# Altium project Pi3_SMD.PrjPcb
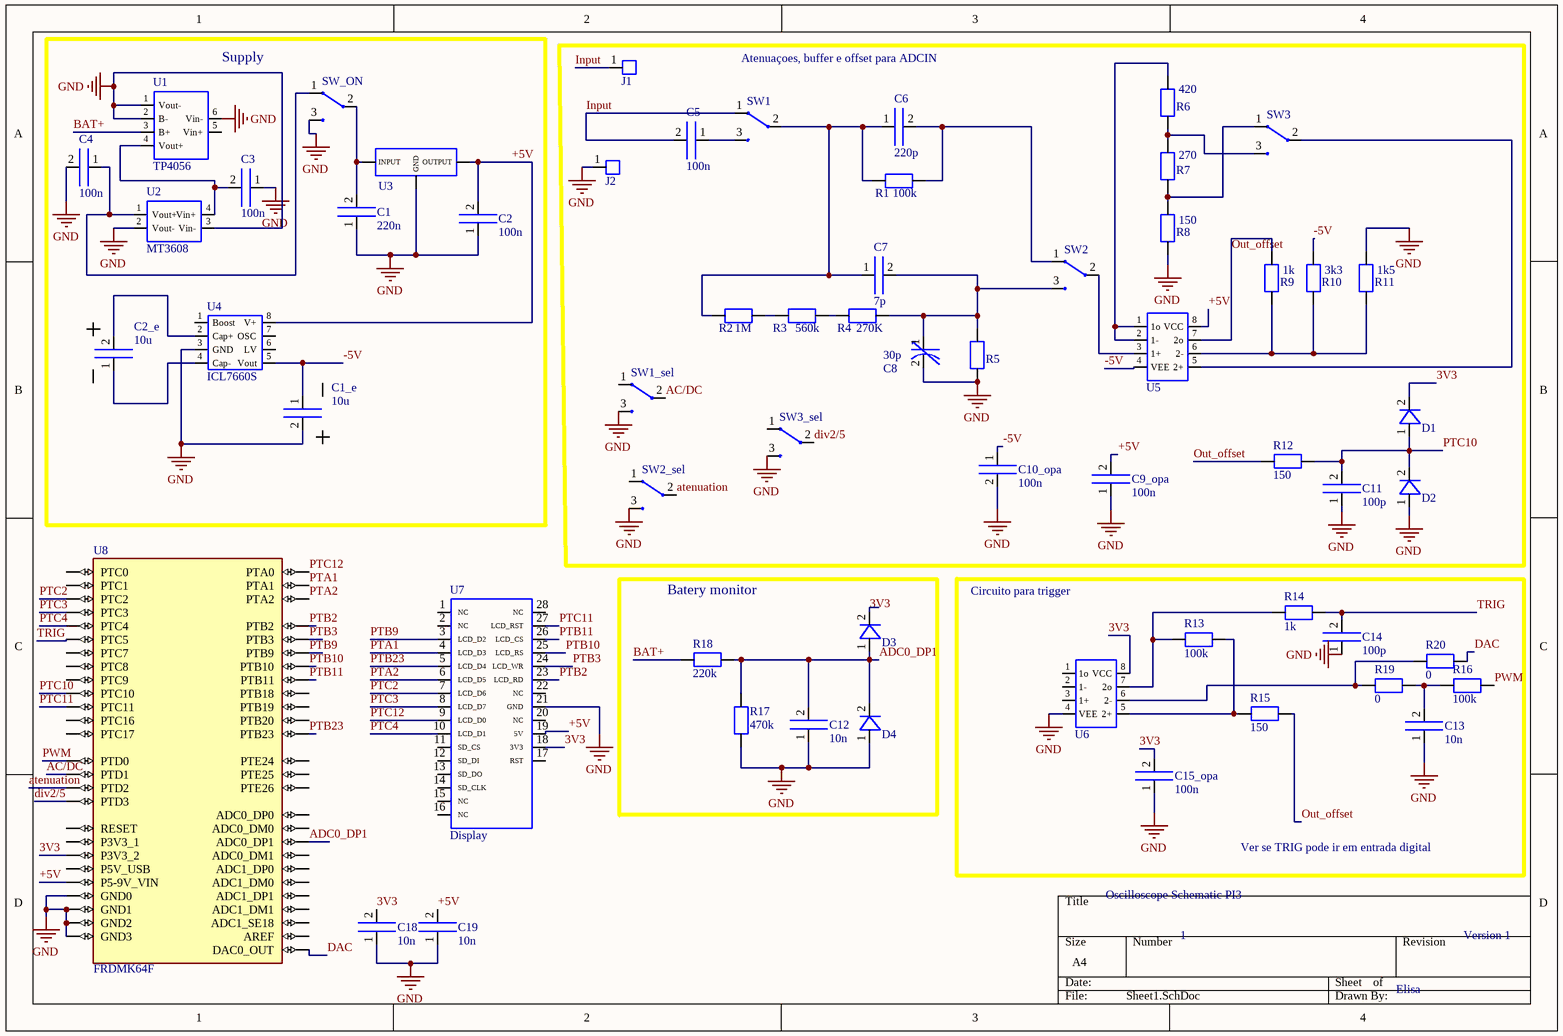
[diagram p0: Sheet1.SchDoc]
1 sheet, 60 parts. Net scope: global (net labels, ports and power ports of the same name join across sheets).
Board file: PCB2.PcbDoc

## Sheet Sheet1.SchDoc
size A4; SheetNumber: 1; SheetTotal: 1

### Parts
C1  220n  [0805_CAPACITOR]
C1_e  10u  [CAP_THT]
C2  100n  [0805_CAPACITOR]
C2_e  10u  [CAP_THT]
C3  100n  [0805_CAPACITOR]
C4  100n  [0805_CAPACITOR]
C5  100n  [0805_CAPACITOR]
C6  220p  [0805_CAPACITOR]
C7  7p  [0805_CAPACITOR]
C8  30p  [CAP_TRIMM_THT]
C9_opa  100n  [0805_CAPACITOR]
C10_opa  100n  [0805_CAPACITOR]
C11  100p  [0805_CAPACITOR]
C12  10n  [0805_CAPACITOR]
C13  10n  [0805_CAPACITOR]
C14  100p  [0805_CAPACITOR]
C15_opa  100n  [0805_CAPACITOR]
C18  10n  [0805_CAPACITOR]
C19  10n  [0805_CAPACITOR]
D1  1N4148WT  [SOD-523]  (value not drawn)
D2  1N4148WT  [SOD-523]  (value not drawn)
D3  1N4148WT  [SOD-523]  (value not drawn)
D4  1N4148WT  [SOD-523]  (value not drawn)
J1  Banana_conector  [Banana_bourne_RED]  (value not drawn)
J2  Banana_conector  [Banana_bourne_BLACK]  (value not drawn)
R1  100k  [0805_RESISTOR]
R2  1M  [0805_RESISTOR]
R3  560k  [0805_RESISTOR]
R4  270K  [0805_RESISTOR]
R5  200k  [0805_RESISTOR]  (value not drawn)
R6  420  [0805_RESISTOR]
R7  270  [0805_RESISTOR]
R8  150  [0805_RESISTOR]
R9  1k  [0805_RESISTOR]
R10  3k3  [0805_RESISTOR]
R11  1k5  [0805_RESISTOR]
R12  150  [0805_RESISTOR]
R13  100k  [0805_RESISTOR]
R14  1k  [0805_RESISTOR]
R15  150  [0805_RESISTOR]
R16  100k  [0805_RESISTOR]
R17  470k  [0805_RESISTOR]
R18  220k  [0805_RESISTOR]
R19  0  [0805_RESISTOR]
R20  0  [0805_RESISTOR]
SW1  SW  [SW]  (value not drawn)
SW1_sel  SW  [SW]  (value not drawn)
SW2  SW  [SW]  (value not drawn)
SW2_sel  SW  [SW]  (value not drawn)
SW3  SW  [SW]  (value not drawn)
SW3_sel  SW  [SW]  (value not drawn)
SW_ON  SW  [SW]  (value not drawn)
U1  TP4056  [TP0456]
U2  MT3608  [MT3608]
U3  L7805  [D2PAK]  (value not drawn)
U4  ICL7660S  [8 -PDIP]
U5  TL082C  [8-SOIC]  (value not drawn)
U6  TL082C  [8-SOIC]  (value not drawn)
U7  Display  [Display]
U8  FRDMK64F  [FRDMK64F]

### Blocks framed on the sheet
Supply: C1 C1_e C2 C2_e C3 C4 SW_ON U1-U4
Atenuaçoes, buffer e offset para ADCIN: C5-C8 C9_opa C10_opa C11 D1 D2 J1 J2 R1-R12 SW1 SW1_sel SW2 SW2_sel SW3 SW3_sel U5
Batery monitor: C12 D3 D4 R17 R18

### Nets
GND: C1.1 C1_e.2 C2.1 C3.1 C4.2 C8.2 C9_opa.1 C10_opa.2 C11.1 C12.1 C13.1 C14.1 C15_opa.1 C18.1 C19.1 D2.1 D4.1 J2.1 R5.1 R8.1 R11.2 R17.2 SW1_sel.3 SW2_sel.3 SW3_sel.3 SW_ON.3 U1.1(Vout-) U1.2(B-) U1.6(Vin-) U2.2(Vout-) U2.3(Vin-) U3.1(GND) U4.3(GND) U6.4(VEE) U7.21(GND) U8.J2-3(GND0) U8.J2-14(GND1) U8.J3-12(GND2) U8.J3-14(GND3)
3V3: C15_opa.2 C18.2 D1.2 D3.2 U6.8(VCC) U7.18(3V3) U8.J3-8(P3V3_2)
+5V: C2.2 C9_opa.2 C19.2 U3.2(OUTPUT) U4.8(V+) U5.8(VCC) U7.19(5V) U8.J3-16(P5-9V_VIN)
-5V: C1_e.1 C10_opa.1 R10.2 U4.5(Vout) U5.4(VEE)
AC/DC: SW1_sel.2 U8.J2-12(PTD1)
ADC0_DP1: C12.2 D3.1 D4.2 R17.1 R18.1 U8.J4-1(ADC0_DP1)
atenuation: SW2_sel.2 U8.J2-8(PTD2)
BAT+: R18.2 U1.3(B+)
DAC: R20.1 U8.J4-11(DAC0_OUT)
div2/5: SW3_sel.2 U8.J2-10(PTD3)
Input: C5.2 J1.1 SW1.1
Out_offset: R9.2 R12.2 R15.1 U5.7(2o)
PTA1: U7.4(LCD_D3) U8.J1-8(PTA1)
PTA2: U7.6(LCD_D5) U8.J1-12(PTA2)
PTB2: U7.23(LCD_RD) U8.J4-2(PTB2)
PTB3: U7.24(LCD_WR) U8.J4-4(PTB3)
PTB9: U7.3(LCD_D2) U8.J1-6(PTB9)
PTB10: U7.25(LCD_RS) U8.J4-6(PTB10)
PTB11: U7.26(LCD_CS) U8.J4-8(PTB11)
PTB23: U7.5(LCD_D4) U8.J1-10(PTB23)
PTC2: U7.7(LCD_D6) U8.J1-14(PTC2)
PTC3: U7.8(LCD_D7) U8.J1-16(PTC3)
PTC4: U7.10(LCD_D1) U8.J2-4(PTC4)
PTC10: C11.2 D1.1 D2.2 R12.1 U8.J4-12(PTC10)
PTC11: U7.27(LCD_RST) U8.J4-10(PTC11)
PTC12: U7.9(LCD_D0) U8.J2-2(PTA0)
PWM: R16.1 U8.J2-6(PTD0)
TRIG: C14.2 R14.1 U8.J1-15(PTC5)
NetC1_2: C1.2 SW_ON.2 U3.3(INPUT)
NetC2_e_1: C2_e.1 U4.4(Cap-)
NetC2_e_2: C2_e.2 U4.2(Cap+)
NetC3_2: C3.2 U1.4(Vout+) U2.4(Vin+)
NetC4_1: C4.1 SW_ON.1 U2.1(Vout+)
NetC5_1: C5.1 SW1.3
NetC6_1: C6.1 C7.1 R1.1 R2.1 SW1.2
NetC6_2: C6.2 R1.2 SW2.1
NetC7_2: C7.2 C8.1 R4.2 R5.2 SW2.3
NetC13_2: C13.2 R16.2 R19.1
NetR2_2: R2.2 R3.1
NetR3_2: R3.2 R4.1
NetR6_1: R6.1 R7.2 SW3.3
NetR6_2: R6.2 U5.1(1o) U5.2(1-)
NetR7_1: R7.1 R8.2 SW3.1
NetR9_1: R9.1 R10.1 R11.1 U5.6(2-)
NetR13_1: R13.1 R15.2 U6.5(2+)
NetR13_2: R13.2 R14.2 U6.7(2o)
NetR19_2: R19.2 R20.2 U6.6(2-)
NetSW2_2: SW2.2 U5.3(1+)
NetSW3_2: SW3.2 U5.5(2+)

Not connected (* = marked no-connect by the designer): SW1_sel 1; SW2_sel 1; SW3_sel 1; U1 5(Vin+); U4 1(Boost) 6(LV) 7(OSC); U6 1(1o) 2(1-) 3(1+); U7 1(NC) 2(NC) 11(SD_CS) 12(SD_DI) 13(SD_DO) 14(SD_CLK) 15(NC) 16(NC) 17(RST) 20(NC) 22(NC) 28(NC); U8 J1-1(PTB18) J1-2(PTC16) J1-3(PTB19) J1-4(PTC17) J1-5(PTC1) J1-7(PTC8) J1-9(PTC9) J1-11(PTC0) J1-13(PTC7) J2-1(PTE26) J2-5(ADC0_DP0) J2-7(ADC0_DM0) J2-11(ADC1_DP0) J2-13(ADC1_DM0) J2-16(AREF) J2-17(ADC1_SE18) J2-18(PTE25) J2-20(PTE24) J3-4(P3V3_1) J3-6(RESET) J3-10(P5V_USB) J4-3(ADC0_DM1) J4-5(ADC1_DP1) J4-7(ADC1_DM1) J4-9(PTB20)

### Notes on the sheet
- Circuito para trigger
- Ver se TRIG pode ir em entrada digital
- Oscilloscope Schematic PI3
- 1
- Version 1
- Elisa

### Library data of the parts
C1-C7 C9_opa C10_opa C11-C14 C15_opa C18 C19 = Capacitor_0805
C1_e C2_e = EEU-FC1E470: CAP ALUM 47UF 20% 25V RADIAL TH
C8 = CAP_TRIMM_THT
R1-R20 = 0805_resistor
U3 = L7805: IC REG LINEAR 5V 1.5A